# Altium schematic sheet MCU.SchDoc
size A4
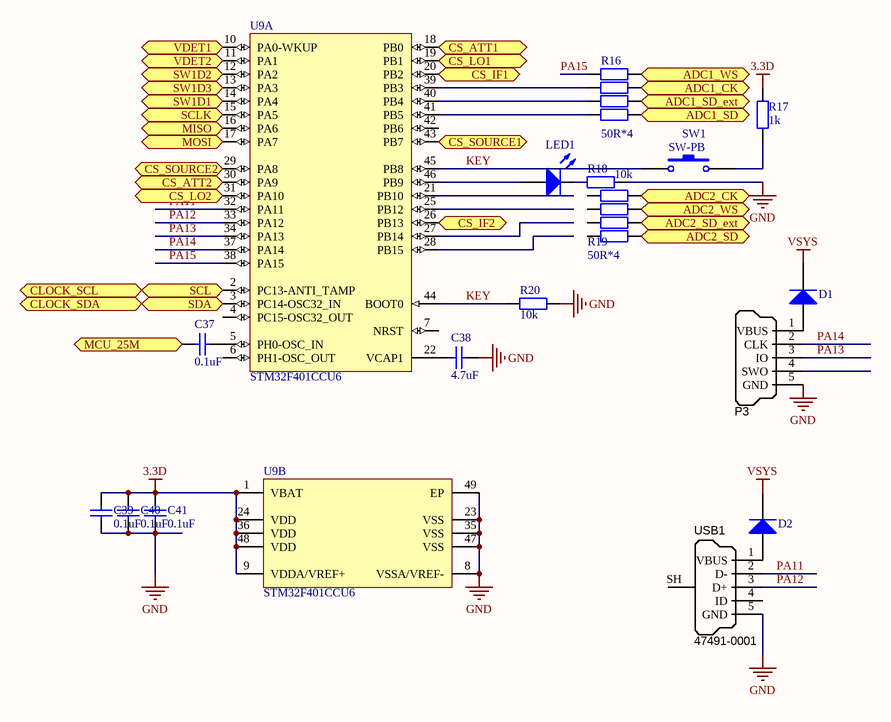
[diagram p0: MCU.SchDoc]

## Parts
C37  value 0.1uF  [0402]  (hidden comment: Cap)
C38  value 4.7uF  [0603L]  (hidden comment: Cap)
C39  value 0.1uF  [0402]  (hidden comment: Cap)
C40  value 0.1uF  [0402]  (hidden comment: Cap)
C41  value 0.1uF  [0402]  (hidden comment: Cap)
D1  (no value)  [LC-SOD-323]
D2  (no value)  [LC-SOD-323]
LED1  LED0  [0603]  (value not drawn)
P3  SWD_MicroUSB  [MICRO-YZX]  (value not drawn)
R16  50R*4  [0402X4]
R17  1k  [0402]
R18  10k  [0402]
R19  50R*4  [0402X4]
R20  value 10k  [0402]  (hidden comment: Res2)
SW1  SW-PB  [SW3x4]
U9  STM32F401CCU6  [STM-UFQFPN48_N]  (parts A,B of 2)
USB1  Manufacturer Part Number 1: 47491-0001  [MICRO-YZX]  (hidden comment: USB Micro Type B)

## Ports
ADC1_CK, ADC1_SD, ADC1_SD_ext, ADC1_WS, ADC2_CK, ADC2_SD, ADC2_SD_ext, ADC2_WS, CLOCK_SCL, CLOCK_SDA, CS_ATT1, CS_ATT2, CS_IF1, CS_IF2, CS_LO1, CS_LO2, CS_SOURCE1, CS_SOURCE2, MCU_25M, MISO, MOSI, SCL, SCLK, SDA, SW1D1, SW1D2, SW1D3, VDET1, VDET2

## Nets
3.3D: C39.2 C40.2 C41.2 R17.2 U9.1(VBAT) U9.9(VDDA/VREF+) U9.24(VDD) U9.36(VDD) U9.48(VDD)
GND: C38.1 C39.1 C40.1 C41.1 P3.5(GND) R18.2 R20.2 U9.8(VSSA/VREF-) U9.23(VSS) U9.35(VSS) U9.47(VSS) U9.49(EP) USB1.5(GND)
VSYS: D1.2(K) D2.2(K)
ADC1_CK: R16.2 ; port ADC1_CK
ADC1_SD: R16.4 ; port ADC1_SD
ADC1_SD_ext: R16.3 ; port ADC1_SD_ext
ADC1_WS: R16.1 ; port ADC1_WS
ADC2_CK: R19.1 ; port ADC2_CK
ADC2_SD: R19.4 ; port ADC2_SD
ADC2_SD_ext: R19.3 ; port ADC2_SD_ext
ADC2_WS: R19.2 ; port ADC2_WS
CLOCK_SCL: U9.2(PC13-ANTI_TAMP) ; port SCL, port CLOCK_SCL
CLOCK_SDA: U9.3(PC14-OSC32_IN) ; port SDA, port CLOCK_SDA
CS_ATT1: U9.18(PB0) ; port CS_ATT1
CS_ATT2: U9.30(PA9) ; port CS_ATT2
CS_IF1: U9.20(PB2) ; port CS_IF1
CS_IF2: U9.26(PB13) ; port CS_IF2
CS_LO1: U9.19(PB1) ; port CS_LO1
CS_LO2: U9.31(PA10) ; port CS_LO2
CS_SOURCE1: U9.43(PB7) ; port CS_SOURCE1
CS_SOURCE2: U9.29(PA8) ; port CS_SOURCE2
KEY: R20.1 SW1.1 U9.44(BOOT0) U9.45(PB8)
MCU_25M: C37.2 ; port MCU_25M
MISO: U9.16(PA6) ; port MISO
MOSI: U9.17(PA7) ; port MOSI
PA11: U9.32(PA11) USB1.2(D-)
PA12: U9.33(PA12) USB1.3(D+)
PA13: P3.3(IO) U9.34(PA13)
PA14: P3.2(CLK) U9.37(PA14)
PA15: R16.8 U9.38(PA15)
SCLK: U9.15(PA5) ; port SCLK
SW1D1: U9.14(PA4) ; port SW1D1
SW1D2: U9.12(PA2) ; port SW1D2
SW1D3: U9.13(PA3) ; port SW1D3
VDET1: U9.10(PA0-WKUP) ; port VDET1
VDET2: U9.11(PA1) ; port VDET2
NetC37_1: C37.1 U9.5(PH0-OSC_IN)
NetC38_2: C38.2 U9.22(VCAP1)
NetD1_1: D1.1(A) P3.1(VBUS)
NetD2_1: D2.1(A) USB1.1(VBUS)
NetLED1_1: LED1.1(A) U9.46(PB9)
NetLED1_2: LED1.2(K) R18.1
NetR16_5: R16.5 U9.41(PB5)
NetR16_6: R16.6 U9.40(PB4)
NetR16_7: R16.7 U9.39(PB3)
NetR17_1: R17.1 SW1.2

Not connected (* = marked no-connect by the designer): P3 4(SWO); R19 5 6 7 8; U9 4(PC15-OSC32_OUT) 6(PH1-OSC_OUT) 7(NRST) 21(PB10) 25(PB12) 27(PB14) 28(PB15) 42(PB6); USB1 4(ID) SH(Shell)

## Library data of the parts
C37-C41 = Cap: Capacitor; Published: 8-Jun-2000; LatestRevisionDate: 17-Jul-2002; LatestRevisionNote: Re-released for DXP Platform.; PackageReference: RAD-0.3; Publisher: Altium Limited; PackageDescription: Radial Cap, Thru-Hole; 2 Leads; 0.3 in Pin Spacing
D1 D2 = Diode 1N4148: High Conductance Fast Diode; Published: 8-Jun-2000; LatestRevisionDate: 17-Jul-2002; LatestRevisionNote: Re-released for DXP Platform.; DatasheetVersion: 1997; PackageReference: DO-35; Publisher: Altium Limited; PackageDescription: Diode, Axial; Body 3.8 x 1.9 mm (LxDia. max), Lead Dia. 0.53 mm (max); Code_JEDEC: DO-204-AH; ComponentLink1Description: Manufacturer Link; ComponentLink1URL: http://www.fairchildsemi.com/; ComponentLink2Description: Datasheet; ComponentLink2URL: http://www.fairchildsemi.com/ds/1N%2F1N4148.pdf
LED1 = LED0: Typical INFRARED GaAs LED; Published: 8-Jun-2000; LatestRevisionDate: 08-Jul-2005; LatestRevisionNote: Mech Layer 1 removed.; PackageReference: LED-0; Publisher: Altium Limited; PackageDescription: LED; 2 Leads
P3 = SWD_MicroUSB: Connector SMD USB Micro Type B middle mount; Manufacturer 1: Molex Inc; SCDType: undef; Package / Case: SMD; Supplier 1: Digi-Key; Supplier Part Number 1: WM17142CT-ND
R16 R19 = Res*4: Resistor; Published: 8-Jun-2000; LatestRevisionDate: 17-Jul-2002; LatestRevisionNote: Re-released for DXP Platform.; PackageReference: AXIAL-0.4; Publisher: Altium Limited; PackageDescription: Axial Device, Thru-Hole; 2 Leads; 0.4 in Pin Spacing
R17 R18 = Res2: Resistor; Value: 0Ohm; Published: 8-Jun-2000; LatestRevisionDate: 17-Jul-2002; LatestRevisionNote: Re-released for DXP Platform.; PackageReference: AXIAL-0.4; Publisher: Altium Limited; PackageDescription: Axial Device, Thru-Hole; 2 Leads; 0.4 in Pin Spacing
R20 = Res2: Resistor; Published: 8-Jun-2000; LatestRevisionDate: 17-Jul-2002; LatestRevisionNote: Re-released for DXP Platform.; PackageReference: AXIAL-0.4; Publisher: Altium Limited; PackageDescription: Axial Device, Thru-Hole; 2 Leads; 0.4 in Pin Spacing
SW1 = SW-PB: Switch; Published: 24-Mar-1999; LatestRevisionDate: 17-Jul-2002; LatestRevisionNote: Re-released for DXP Platform.; PackageReference: SPST-2; Publisher: Altium Limited; PackageDescription: Switch; 2 Leads
U9 = STM32F401CCU6: ARM Cortex-M4 32-bit MCU+FPU, 105 DMIPS, 256 kB Flash, 64 kB Internal RAM, 36 I/Os, 48-pin UFQFPN, -40 to 85 degC, Tray; Manufacturer: STMicroelectronics; FLASH Size (Prog) (kB): 256; I/Os (High Current): 36; Internal RAM Size (kB): 64; Operating Frequency(F) (Processor speed) (MHz): 84; Supply Voltage(Vcc) max (V): 3.6; Supply Voltage(Vcc) min (V): 1.8; DatasheetVersion: Rev. 1; PackageVersion: Rev. 1, 04/2013; PackageReference: UFQFPN48; PackageDescription: 48-Pin Ultra Thin Fine Pitch Quad Flat No-Lead, 7 x 7 x 0.6 mm Body, 0.5 mm Pitch, Exposed Pad; Supplier 1: Newark; Supplier Part Number 1: 19X6217; Supplier 2: Mouser; Supplier Part Number 2: 511-STM32F401CCU6; Core: ARM Cortex-M4; Packing: Tray; Mounting Technology: Surface Mount; PartNumber: STM32F401CCU6; ComponentLink1Description: Manufacturer URL; ComponentLink1URL: http://www.st.com/web/en/home.html; ComponentLink2Description: Datasheet; ComponentLink2URL: http://www.st.com/st-web-ui/static/active/en/resource/technical/document/data_brief/DM00071938.pdf; ComponentLink3Description: Package Specification; ComponentLink3URL: http://www.st.com/st-web-ui/static/active/en/resource/technical/document/data_brief/DM00071938.pdf
USB1 = USB_Micro_TypeB: Connector SMD USB Micro Type B middle mount; Manufacturer 1: Molex Inc; SCDType: undef; Package / Case: SMD; Supplier 1: Digi-Key; Supplier Part Number 1: WM17142CT-ND